# EAGLE design Odroid Headphone Hat (EAGLE 7.7.0)
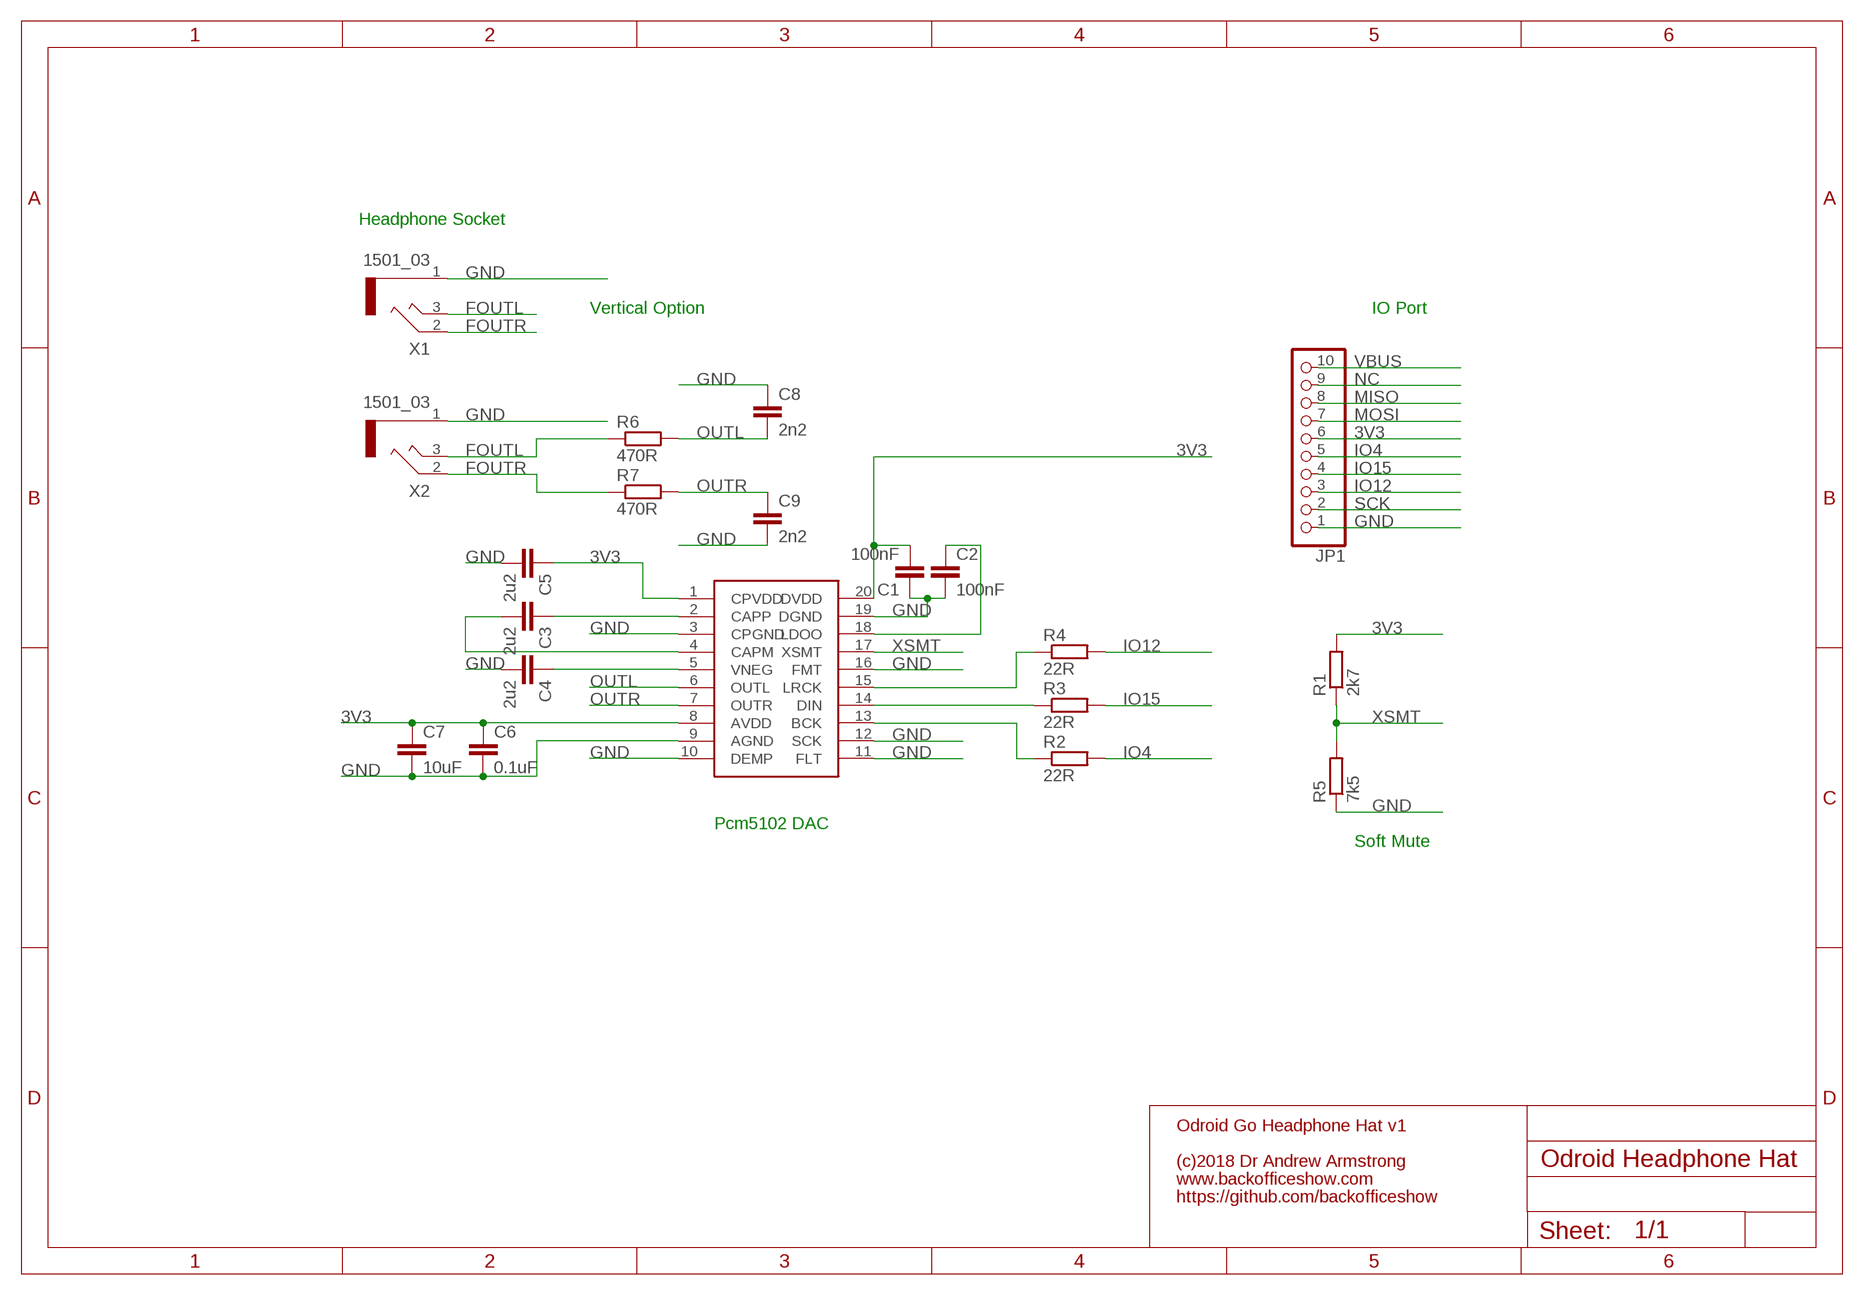
[diagram p0: schematic, sheet 1]

## Parts
C1  100nF  C-EUC0603  [C0603]
C2  100nF  C-EUC0603  [C0603]
C3  2u2  C-EUC0603  [C0603]
C4  2u2  C-EUC0603  [C0603]
C5  2u2  C-EUC0603  [C0603]
C6  0.1uF  C-EUC0603  [C0603]
C7  10uF  C-EUC0603  [C0603]
C8  2n2  C-EUC0603  [C0603]
C9  2n2  C-EUC0603  [C0603]
JP1  PINHD-1X10/90  [1X10/90]
R1  2k7  R-EU_R0603  [R0603]
R2  22R  R-EU_R0603  [R0603]
R3  22R  R-EU_R0603  [R0603]
R4  22R  R-EU_R0603  [R0603]
R5  7k5  R-EU_R0603  [R0603]
R6  470R  R-EU_R0603  [R0603]
R7  470R  R-EU_R0603  [R0603]
U$1  PCM5102  [TSSOP20]
X1  1501_03  [1501_03]
X2  1501_03  [1501_03]

## Nets
3V3: C1.2 C5.1 C6.1 C7.1 JP1.6 R1.2 U$1.1(CPVDD) U$1.8(AVDD) U$1.20(DVDD)
FOUTL: R6.1 X1.3 X2.3
FOUTR: R7.1 X1.2 X2.2
GND: C1.1 C2.2 C4.2 C5.2 C6.2 C7.2 C8.1 C9.2 JP1.1 R5.1 U$1.3(CPGND) U$1.9(AGND) U$1.10(DEMP) U$1.11(FLT) U$1.12(SCK) U$1.16(FMT) U$1.19(DGND) X1.1 X2.1
IO4: JP1.5 R2.2
IO12: JP1.3 R4.2
IO15: JP1.4 R3.2
MISO: JP1.8
MOSI: JP1.7
N$1: R2.1 U$1.13(BCK)
N$2: R3.1 U$1.14(DIN)
N$3: R4.1 U$1.15(LRCK)
N$4: C2.1 U$1.18(LDOO)
N$12: C3.1 U$1.2(CAPP)
N$14: C3.2 U$1.4(CAPM)
N$15: C4.1 U$1.5(VNEG)
NC: JP1.9
OUTL: C8.2 R6.2 U$1.6(OUTL)
OUTR: C9.1 R7.2 U$1.7(OUTR)
SCK: JP1.2
VBUS: JP1.10
XSMT: R1.1 R5.2 U$1.17(XSMT)

## Notes on the sheet
- Headphone Socket
- Vertical Option | IO Port
- Pcm5102 DAC
- Soft Mute
- Odroid Go Headphone Hat v1
- (c)2018 Dr Andrew Armstrong
- www.backofficeshow.com
- https://github.com/backofficeshow

## Library data of the parts
C1-C9 = resistor:C-EU: CAPACITOR, European symbol
JP1 = pinhead:PINHD-1X10: PIN HEADER
R1-R7 = resistor:R-EU_: RESISTOR, European symbol
U$1 = PCM5102:PCM5102
X1 X2 = con-lumberg:1501_03: Klinkensteckverbinder nach JISC 6560, 2,5 mm Jack connectors according to JISC 6560, 2.5 mm Source: http://www.lumberg.com/Produkte/PDFs/1501_03.pdf

## Board
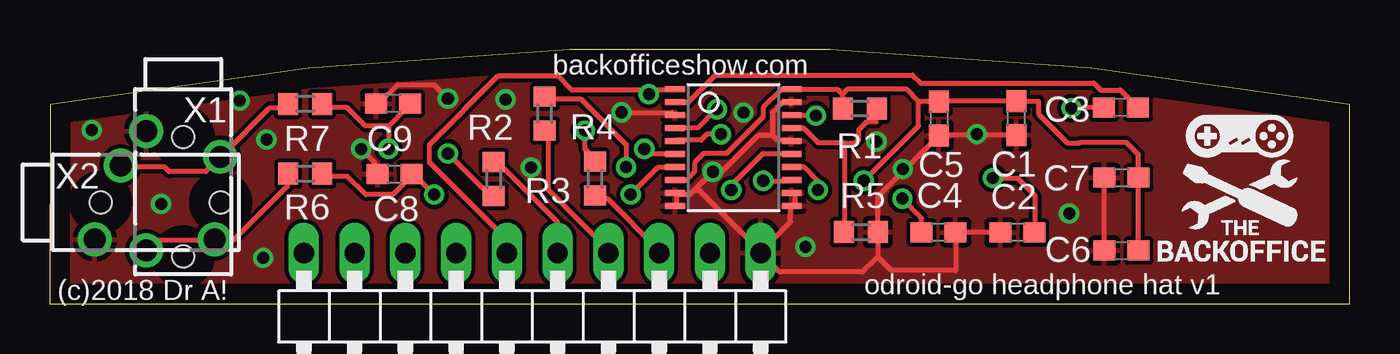
[diagram p1: board, top side]
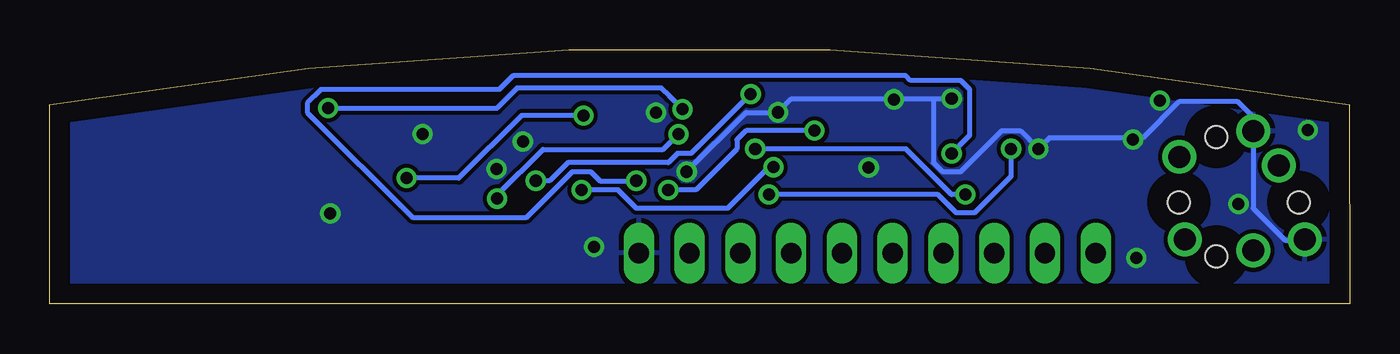
[diagram p2: board, bottom side, seen from below]

Size 65.02 x 12.73 mm. Coordinates in mm from the lower left corner, seen from the top.
Outline: 0,0.01 65.02,0 65.02,10 arc20 0.02,10 0,0.01
Copper layers (1*16): Top 0.035mm / dielectric 1.5mm / Bottom 0.035mm
Design rules "default *": minimum track width 10mil, minimum drill 24mil, track to track 8mil, track to pad 8mil, pad to pad 8mil, via to via 8mil, smd to smd 8mil, copper to edge 40mil, drill to drill 8mil, minimum pad ring 10mil, minimum via ring 8mil, stop-mask expansion 4mil, vias tented up to drill 26mil, thermal gap 10mil

### Footprints (pad centres in the part's own frame; a part is rotated, then mirrored left to right if it is on the bottom)
C0603 = smd 1.1 x 1: 1 -0.85,0; 2 0.85,0
1X10/90 = drill 1.016 long: 1 -11.43,-3.81; 2 -8.89,-3.81; 3 -6.35,-3.81; 4 -3.81,-3.81; 5 -1.27,-3.81; 6 1.27,-3.81; 7 3.81,-3.81; 8 6.35,-3.81; 9 8.89,-3.81; 10 11.43,-3.81
R0603 = smd 1 x 1.1: 1 -0.85,0; 2 0.85,0
TSSOP20 = smd 0.305 x 0.991: 1 -2.925,-2.918; 2 -2.275,-2.918; 3 -1.625,-2.918; 4 -0.975,-2.918; 5 -0.325,-2.918; 6 0.325,-2.918; 7 0.975,-2.918; 8 1.625,-2.918; 9 2.275,-2.918; 10 2.925,-2.918; 11 2.925,2.918; 12 2.275,2.918; 13 1.625,2.918; 14 0.975,2.918; 15 0.325,2.918; 16 -0.325,2.918; 17 -0.975,2.918; 18 -1.625,2.918; 19 -2.275,2.918; 20 -2.925,2.918
1501_03 = drill 1.1 pad 1.7: 1 -1.85,0.3; 2 1.85,-1; 3 -1.85,-5.7 | hole 1.1: 0,0; 0,-6

### Placement (x,y rotation side)
C1  48.36,9.32 90 top
C2  48.4,3.59 180 top
C3  53.58,9.83 180 top
C4  44.46,3.6 0 top
C5  44.47,9.3 270 top
C6  53.61,2.68 180 top
C7  53.61,6.33 180 top
C8  17.23,6.52 0 top
C9  17.17,10.04 180 top
JP1  24.13,-1.25 180 top
R1  40.52,9.78 180 top
R2  22.2,6.26 90 top
R3  24.75,9.54 270 top
R4  27.27,6.28 270 top
R5  40.57,3.6 180 top
R6  12.77,6.53 0 top
R7  12.76,10.02 0 top
U$1  34.19,7.83 270 top
X1  6.66,8.38 0 top
X2  2.54,5.1 90 top

### Tracks (layer width: path | path; a pad name or v marks a point on that pad's centre or on a via)
3V3  (via drill 0.61)
  Top 0.254: 39.64,10.51 39.4,10.76 U$1.20 37.05,10.74 36.6,10.74 35.68,9.83 35.68,9.37 33.85,7.54 32.71,7.54 32.25,7.09 32.25,6.63 31.8,6.17 31.34,6.17 U$1.8 | 39.64,10.51 39.64,9.81 R1.2 | C6.1 C7.1 54.46,7.48 53.86,8.09 51.53,8.09 51.52,8.08 50.91,8.08 49.46,9.52 49.46,10.15 48.37,10.15 C1.2 44.49,10.17 C5.1 43.49,10.15 | 43.49,10.15 42.87,10.77 39.9,10.77 39.64,10.51 | 29.97,10.74 26.08,10.74 25.4,11.43 22.42,11.43 18.99,8 18.99,7.09 22.65,3.43 22.65,2.74 JP1.6 | 29.97,10.74 31.11,10.74 U$1.1 | v40.71,6.17 43.45,8.91 43.45,10.06 43.49,10.15 | 29.97,10.74 v29.97,10.52
  Bottom 0.254: v40.71,6.17 40.03,6.17 39.11,7.09 34.08,7.09 33.62,7.54 32.94,7.54 v29.97,10.52
FOUTL
  Top 0.254: 8.25,3.2 9.16,3.2 11.91,5.94 11.91,6.4 R6.1 | 8.25,3.2 X2.3 | 8.25,3.2 5.34,3.2 X1.3
FOUTR
  Top 0.254: R7.1 11.91,9.83 10.99,9.83 8.71,7.54 X1.2 8.48,7.32 7.79,6.63 5.96,6.63 5.74,6.86 3.68,6.86 X2.2
GND  (via drill 0.6, 0.61)
  Top 0.254: C6.2 C7.2 52.65,6.33 | C1.1 44.49,8.47 C5.2 41.42,5.4 R5.1 41.42,2.37 | C2.2 45.32,3.59 | 45.32,3.59 C4.2 | 41.42,2.37 40.66,1.61 36.51,1.61 JP1.1 | 45.32,3.59 45.32,1.7 45.31,1.69 42.1,1.69 41.42,2.37 | U$1.12 37.28,5.49 37.28,5.03 U$1.11 37.05,4.8 37.05,4.12 35.68,2.74 JP1.1 | 36.14,8.46 36.37,8.23 37.05,8.23 U$1.16 | 36.14,8.46 36.14,9.6 36.6,10.06 37.05,10.06 U$1.19 | 31.34,5.49 31.34,5.03 U$1.10 | v28.6,9.6 31.11,9.6 U$1.3 | 32.25,5.71 32.02,5.49 31.34,5.49 | 32.25,5.71 v33.17,6.63 33.62,6.63 35.45,8.46 36.14,8.46 | 31.34,5.49 U$1.9 | v19.91,10.29 19.22,10.97 17.39,10.97 16.48,10.06 C9.2 | v15.57,7.77 16.25,7.09 16.25,6.63 C8.1 | 32.25,5.71 32.48,5.71 35.45,2.74 JP1.1
  Bottom 0.254: v33.17,6.63 30.2,9.6 v28.6,9.6 27.91,10.29 20.82,10.29 | 20.82,10.29 v19.91,10.29 | 20.82,10.29 20.82,7.09 20.37,6.63 19.45,6.63 17.39,8.69 16.48,8.69 v15.57,7.77 15.02,8.32 10.35,8.32 8.54,10.13 5.59,10.13 4.82,9.36 4.82,8.46 | 4.82,8.46 4.82,4.8 3.22,3.2 2.31,3.2 X2.1 | 4.82,8.46 X1.1
  other vias: 5.55,5.01 37.8,2.87 22.8,10.25 10.83,8.24 10.67,2.32 9.48,10.2 2.08,8.71 50.99,4.53 46.39,8.52 24.06,6.83 42.68,6.76 34.7,9.6 41.36,8.15
  pour Top: -2.53,33 -3.19,33 -3.19,-2.63 75.32,-2.63 75.32,33.42 -1.13,33.42 -1.13,33.25
  pour Bottom: -2.85,-13.58 69.24,-13.58 69.24,16.55 -4.58,16.55 -4.58,-13.58
IO4
  Top 0.254: R2.2 22.42,7.09 25.4,4.12 25.4,2.74 JP1.5
IO12
  Top 0.254: R4.2 27.45,5.26 27.91,5.26 30.42,2.74 JP1.3
IO15
  Top 0.254: R3.2 24.94,8.69 24.94,5.71 27.91,2.74 JP1.4
N$1  (via drill 0.61)
  Top 0.254: v35.68,6.17 37.05,6.17 U$1.13 | v19.91,7.54 22.19,5.26 R2.1
  Bottom 0.254: v35.68,6.17 37.51,6.17 37.97,6.63 38.88,6.63 41.17,4.34 46.88,4.34 52.14,9.6 52.14,10.06 51.46,10.74 42.54,10.74 41.85,11.43 22.19,11.43 21.97,11.2 19.45,11.2 18.99,10.74 18.99,8.46 v19.91,7.54
N$2  (via drill 0.61)
  Top 0.254: v38.43,5.71 38.43,6.17 37.74,6.86 37.28,6.86 U$1.14 | v28.82,6.86 28.82,8 26.54,10.29 24.94,10.29 R3.1
  Bottom 0.254: v38.43,5.71 36.6,5.71 35.68,4.8 31.11,4.8 29.05,6.86 v28.82,6.86
N$3  (via drill 0.61)
  Top 0.254: v34.08,5.71 34.08,5.94 35.68,7.54 37.05,7.54 U$1.15 | v26.77,8.69 26.77,7.77 27.22,7.32 R4.1
  Bottom 0.254: v34.08,5.71 32.71,5.71 30.65,7.77 30.65,8.23 30.2,8.69 v26.77,8.69
N$4  (via drill 0.6)
  Top 0.254: U$1.18 38.26,9.46 v38.32,9.45 | v47.18,6.31 48.4,6.31 49.27,5.44 49.27,3.6 C2.1
  Bottom 0.254: v38.32,9.45 41.42,9.45 44.57,6.3 v47.17,6.3 v47.18,6.31
N$12
  Top 0.254: U$1.2 31.94,10.11 33.3,11.47 43.16,11.47 43.57,11.07 52.23,11.07 52.57,10.72 53.55,10.72 C3.1
N$14  (via drill 0.6)
  Top 0.254: C3.2 51.13,9.84 v51.1,9.81 | v33.37,9.75 33.32,9.75 32.39,8.82 31.29,8.82 U$1.4
  Bottom 0.254: v51.1,9.81 42.66,9.81 41.64,10.82 34.44,10.82 34,10.39 34,10.38 v33.37,9.75
N$15  (via drill 0.6)
  Top 0.254: C4.1 43.61,4.31 v42.64,5.28 | v33.58,8.5 32.87,8.5 32.57,8.2 31.32,8.2 U$1.5
  Bottom 0.254: v42.64,5.28 42.64,5.46 40.36,7.74 34.34,7.74 v33.58,8.5
OUTL  (via drill 0.61)
  Top 0.254: v29.74,7.77 29.97,7.54 31.11,7.54 U$1.6 | v19.22,5.49 18.31,6.4 C8.2 18.08,6.4 17.17,5.49 15.79,5.49 14.88,6.4 13.74,6.4 R6.2
  Bottom 0.254: v29.74,7.77 22.19,7.77 19.91,5.49 v19.22,5.49
OUTR  (via drill 0.61)
  Top 0.254: v29.05,5.49 30.42,6.86 31.11,6.86 U$1.7 | 16.94,8.91 v16.94,7.77 | 16.94,8.91 17.85,9.83 C9.1 | 16.94,8.91 15.79,8.91 14.88,9.83 13.74,9.83 R7.2
  Bottom 0.254: v29.05,5.49 20.59,5.49 19.68,4.57 18.77,4.57 16.94,6.4 v16.94,7.77
XSMT
  Top 0.254: R1.1 41.33,9.75 41.33,9.12 40.85,9.12 40.46,8.72 40.46,8.24 40.28,8.07 39.74,8.07 | 39.74,8.07 39.74,3.62 R5.2 | 39.74,8.07 38.44,8.07 37.7,8.81 U$1.17

### Text on the board
tPlace: backofficeshow.com | (c)2018 Dr A! | odroid-go headphone hat v1